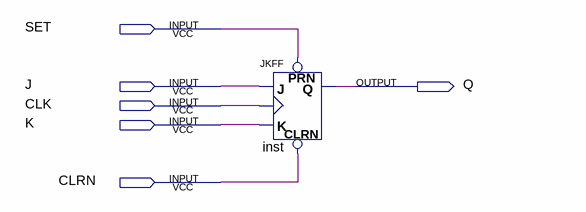
[diagram p0: schematic sheet]
// Quartus schematic Question5.bdf as structural Verilog: 1 symbols, 6 pins
module Question5 (
  input  SET,
  input  J,
  input  CLK,
  input  K,
  input  CLRN,
  output Q
);

  JKFF inst (.PRN(SET), .CLRN(CLRN), .K(K), .J(J), .CLK(CLK), .Q(Q));
endmodule
